# Altium schematic sheet GPIOs.SchDoc: POLYSOME CRYPTO 01
size A4; Revision: V1; SheetNumber: 6; SheetTotal: 8; ProjectName: POLYSOME CRYPTO 01
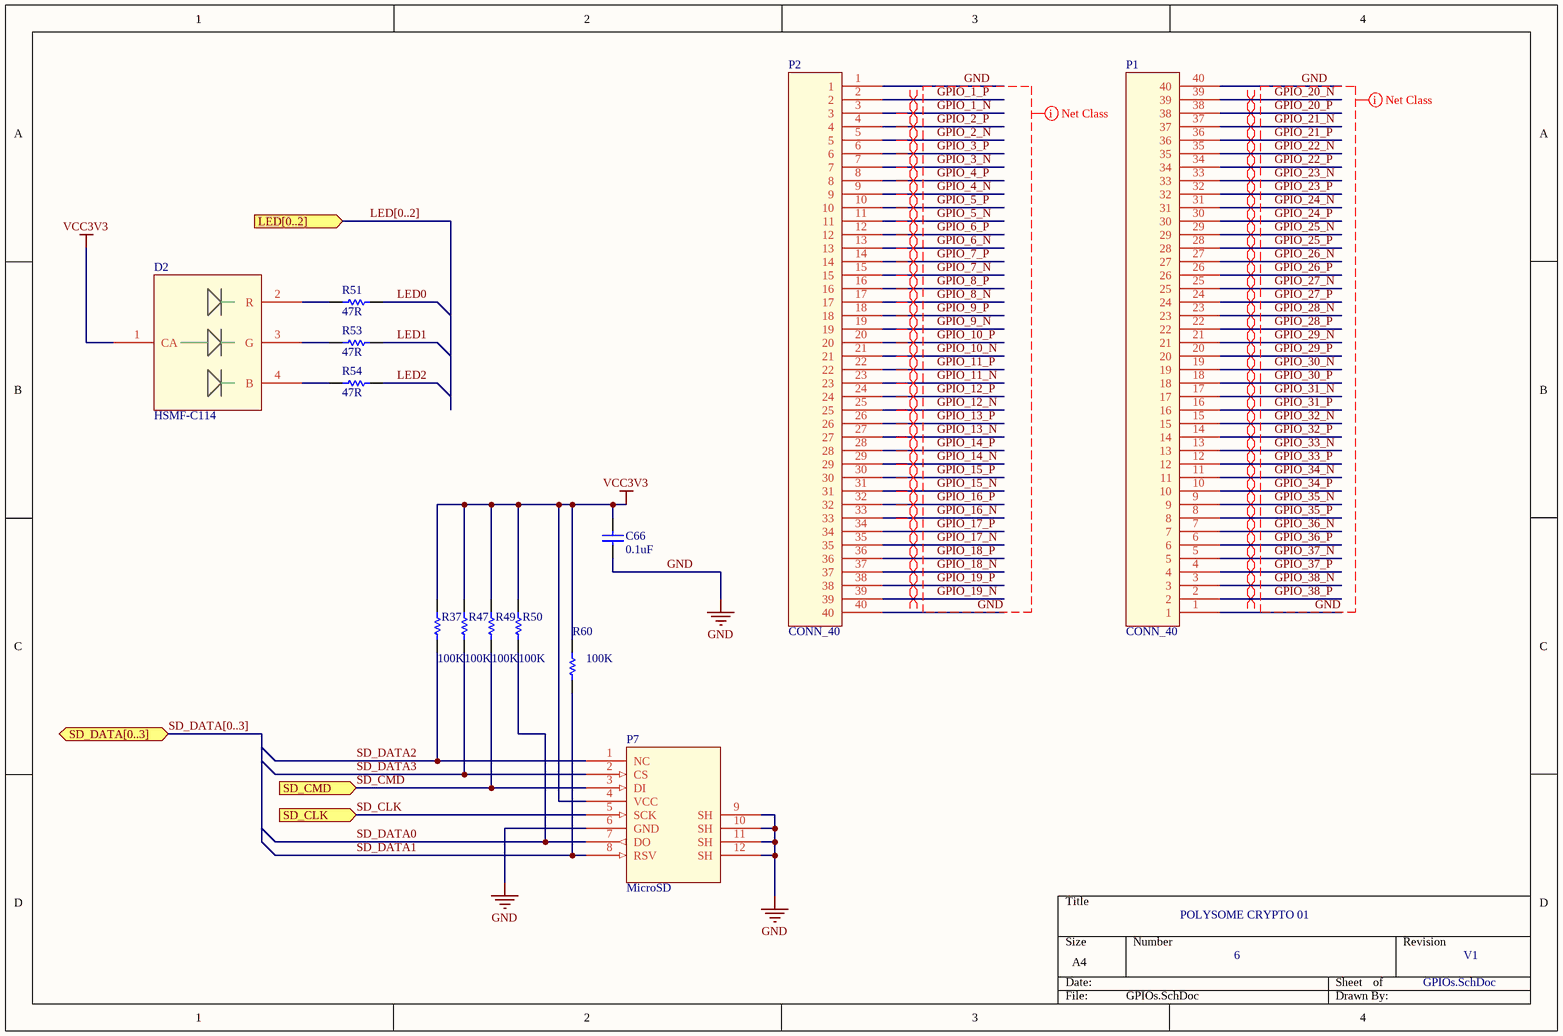
[diagram p0: GPIOs.SchDoc]

## Parts
C66  value 0.1uF  [0402]  (hidden comment: Cap Semi)
D2  HSMF-C114  [DFN110P150X35-4N]
P1  CONN_40  [FH12-40S-0.5SH]
P2  CONN_40  [FH12-40S-0.5SH]
P7  MicroSD  [MicroSD]
R37  value 100K  [0402]  (hidden comment: Res Semi)
R47  value 100K  [0402]  (hidden comment: Res Semi)
R49  value 100K  [0402]  (hidden comment: Res Semi)
R50  value 100K  [0402]  (hidden comment: Res Semi)
R51  value 47R  [0402]  (hidden comment: Res Semi)
R53  value 47R  [0402]  (hidden comment: Res Semi)
R54  value 47R  [0402]  (hidden comment: Res Semi)
R60  value 100K  [0402]  (hidden comment: Res Semi)

## Ports
LED[0..2] (in), SD_CLK (in), SD_CMD (in), SD_DATA[0..3] (bidir)

## Nets
GND: C66.1 P1.1 P1.40 P2.1 P2.40 P7.6(GND) P7.9(SH) P7.10(SH) P7.11(SH) P7.12(SH)
VCC3V3: C66.2 D2.1(CA) P7.4(VCC) R37.2 R47.2 R49.2 R50.2 R60.2
GPIO_1_N: P2.3
GPIO_1_P: P2.2
GPIO_2_N: P2.5
GPIO_2_P: P2.4
GPIO_3_N: P2.7
GPIO_3_P: P2.6
GPIO_4_N: P2.9
GPIO_4_P: P2.8
GPIO_5_N: P2.11
GPIO_5_P: P2.10
GPIO_6_N: P2.13
GPIO_6_P: P2.12
GPIO_7_N: P2.15
GPIO_7_P: P2.14
GPIO_8_N: P2.17
GPIO_8_P: P2.16
GPIO_9_N: P2.19
GPIO_9_P: P2.18
GPIO_10_N: P2.21
GPIO_10_P: P2.20
GPIO_11_N: P2.23
GPIO_11_P: P2.22
GPIO_12_N: P2.25
GPIO_12_P: P2.24
GPIO_13_N: P2.27
GPIO_13_P: P2.26
GPIO_14_N: P2.29
GPIO_14_P: P2.28
GPIO_15_N: P2.31
GPIO_15_P: P2.30
GPIO_16_N: P2.33
GPIO_16_P: P2.32
GPIO_17_N: P2.35
GPIO_17_P: P2.34
GPIO_18_N: P2.37
GPIO_18_P: P2.36
GPIO_19_N: P2.39
GPIO_19_P: P2.38
GPIO_20_N: P1.39
GPIO_20_P: P1.38
GPIO_21_N: P1.37
GPIO_21_P: P1.36
GPIO_22_N: P1.35
GPIO_22_P: P1.34
GPIO_23_N: P1.33
GPIO_23_P: P1.32
GPIO_24_N: P1.31
GPIO_24_P: P1.30
GPIO_25_N: P1.29
GPIO_25_P: P1.28
GPIO_26_N: P1.27
GPIO_26_P: P1.26
GPIO_27_N: P1.25
GPIO_27_P: P1.24
GPIO_28_N: P1.23
GPIO_28_P: P1.22
GPIO_29_N: P1.21
GPIO_29_P: P1.20
GPIO_30_N: P1.19
GPIO_30_P: P1.18
GPIO_31_N: P1.17
GPIO_31_P: P1.16
GPIO_32_N: P1.15
GPIO_32_P: P1.14
GPIO_33_N: P1.13
GPIO_33_P: P1.12
GPIO_34_N: P1.11
GPIO_34_P: P1.10
GPIO_35_N: P1.9
GPIO_35_P: P1.8
GPIO_36_N: P1.7
GPIO_36_P: P1.6
GPIO_37_N: P1.5
GPIO_37_P: P1.4
GPIO_38_N: P1.3
GPIO_38_P: P1.2
LED0: R51.2
LED1: R53.2
LED2: R54.2
SD_CLK: P7.5(SCK) ; port SD_CLK
SD_CMD: P7.3(DI) R49.1 ; port SD_CMD
SD_DATA0: P7.7(DO) R50.1
SD_DATA1: P7.8(RSV) R60.1
SD_DATA2: P7.1(NC) R37.1
SD_DATA3: P7.2(CS) R47.1
NetD2_2: D2.2(R) R51.1
NetD2_3: D2.3(G) R53.1
NetD2_4: D2.4(B) R54.1

## Buses and harness runs
bus LED[0..2] = port LED[0..2]
bus SD_DATA[0..3] = port SD_DATA[0..3]

## Layout directives
differential pair: GPIO_1_N, GPIO_1_P, GPIO_2_N, GPIO_2_P, GPIO_3_N, GPIO_3_P, GPIO_4_N, GPIO_4_P, GPIO_5_N, GPIO_5_P, GPIO_6_N, GPIO_6_P, GPIO_7_N, GPIO_7_P, GPIO_8_N, GPIO_8_P, GPIO_9_N, GPIO_9_P, GPIO_10_N, GPIO_10_P, GPIO_11_N, GPIO_11_P, GPIO_12_N, GPIO_12_P, GPIO_13_N, GPIO_13_P, GPIO_14_N, GPIO_14_P, GPIO_15_N, GPIO_15_P, GPIO_16_N, GPIO_16_P, GPIO_17_N, GPIO_17_P, GPIO_18_N, GPIO_18_P, GPIO_19_N, GPIO_19_P, GPIO_20_N, GPIO_20_P, GPIO_21_N, GPIO_21_P, GPIO_22_N, GPIO_22_P, GPIO_23_N, GPIO_23_P, GPIO_24_N, GPIO_24_P, GPIO_25_N, GPIO_25_P, GPIO_26_N, GPIO_26_P, GPIO_27_N, GPIO_27_P, GPIO_28_N, GPIO_28_P, GPIO_29_N, GPIO_29_P, GPIO_30_N, GPIO_30_P, GPIO_31_N, GPIO_31_P, GPIO_32_N, GPIO_32_P, GPIO_33_N, GPIO_33_P, GPIO_34_N, GPIO_34_P, GPIO_35_N, GPIO_35_P, GPIO_36_N, GPIO_36_P, GPIO_37_N, GPIO_37_P, GPIO_38_N, GPIO_38_P
net class GPIO: GND, GPIO_1_N, GPIO_1_P, GPIO_2_N, GPIO_2_P, GPIO_3_N, GPIO_3_P, GPIO_4_N, GPIO_4_P, GPIO_5_N, GPIO_5_P, GPIO_6_N, GPIO_6_P, GPIO_7_N, GPIO_7_P, GPIO_8_N, GPIO_8_P, GPIO_9_N, GPIO_9_P, GPIO_10_N, GPIO_10_P, GPIO_11_N, GPIO_11_P, GPIO_12_N, GPIO_12_P, GPIO_13_N, GPIO_13_P, GPIO_14_N, GPIO_14_P, GPIO_15_N, GPIO_15_P, GPIO_16_N, GPIO_16_P, GPIO_17_N, GPIO_17_P, GPIO_18_N, GPIO_18_P, GPIO_19_N, GPIO_19_P, GPIO_20_N, GPIO_20_P, GPIO_21_N, GPIO_21_P, GPIO_22_N, GPIO_22_P, GPIO_23_N, GPIO_23_P, GPIO_24_N, GPIO_24_P, GPIO_25_N, GPIO_25_P, GPIO_26_N, GPIO_26_P, GPIO_27_N, GPIO_27_P, GPIO_28_N, GPIO_28_P, GPIO_29_N, GPIO_29_P, GPIO_30_N, GPIO_30_P, GPIO_31_N, GPIO_31_P, GPIO_32_N, GPIO_32_P, GPIO_33_N, GPIO_33_P, GPIO_34_N, GPIO_34_P, GPIO_35_N, GPIO_35_P, GPIO_36_N, GPIO_36_P, GPIO_37_N, GPIO_37_P, GPIO_38_N, GPIO_38_P

## Library data of the parts
C66 = Cap Semi: Capacitor (Semiconductor SIM Model); Published: 8-Jun-2000; LatestRevisionDate: 29-May-2009; LatestRevisionNote: IPC-7351 Footprint Added.; PackageReference: C1206; Publisher: Altium Limited; PackageDescription: Chip Capacitor
D2 = HSMF-C114: LED CHIP RGB 1.6X1.5X0.35MM SMD; Manufacturer: Avago Technologies US Inc.; Color: Red, Green, Blue (RGB); Wavelength - Dominant: 626nm, 525nm, 470nm; Wavelength - Peak: 637nm, 523nm, 468nm; Millicandela Rating: 85mcd Red, 180mcd Green, 70mcd Blue; Voltage - Forward (Vf) (Typ): 1.9V Red, 3.4V Green, 3.4V Blue; Current - Test: 20mA; Viewing Angle: 140°, 145°, 145°; Lens Type: Diffused; Lens Style/Size: Rectangle with Flat Top, 1.5mm x 1.1mm; Supplier 1: Digi-Key; Manufacturer Part Number: HSMF-C114; RoHS: RoHS Compliant; Category: Optoelectronics; Stock 1: 23973; Pricing 1: 1=2.03, 10=1.62, 25=1.2376, 100=1.125, 250=0.99, 500=0.8325, 1000=0.72 (USD); Packaging: Cut Tape (CT); Package / Case: 0606 (1616 Metric); Size / Dimension: 1.60mm L x 1.50mm W; Height: 0.35mm; Mounting Type: Surface Mount; Luminous Flux @ Current - Test: -; ComponentLink1URL: http://www.avagotech.com/docs/AV02-2451EN; ComponentLink1Description: http://www.avagotech.com/docs/AV02-2451EN; Supplier Part Number 1: 516-1795-1-ND
R37 R47 R49-R51 R53 R54 R60 = Res Semi: Semiconductor Resistor; Published: 8-Jun-2000; LatestRevisionDate: 17-Jul-2002; LatestRevisionNote: Re-released for DXP Platform.; PackageReference: AXIAL-0.5; Publisher: Altium Limited; PackageDescription: Axial Device, Thru-Hole; 2 Leads; 0.5 in Pin Spacing